# EAGLE design main-v2 (EAGLE 7.2.0)
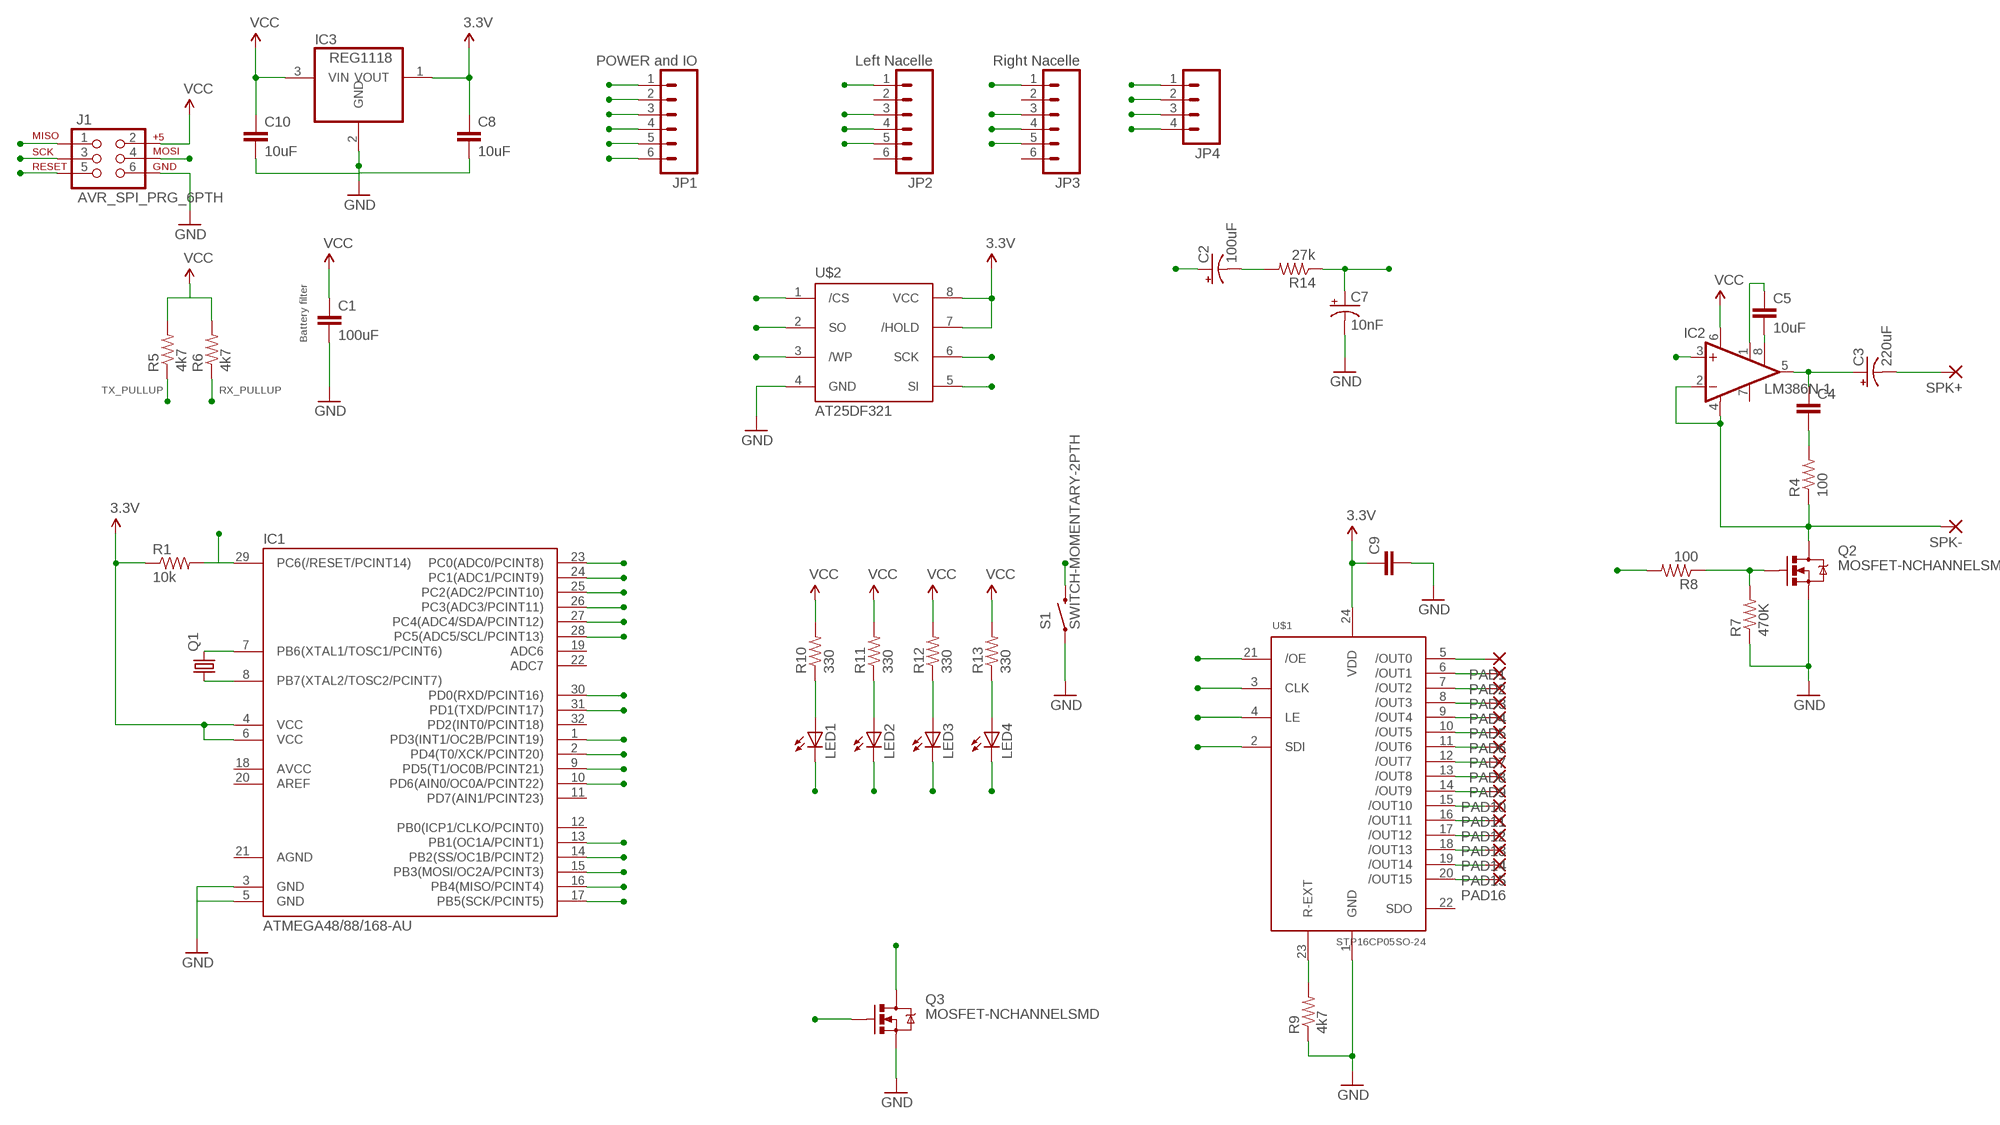
[diagram p0: schematic, sheet 1]

## Parts
C1  100uF  CAPASMD  [CTZ3]
C2  100uF  CAP_POLPTH2  [CPOL-RADIAL-10UF-25V]
C3  220uF  CAP_POLPTH2  [CPOL-RADIAL-10UF-25V]
C4  CAP1206  [1206]
C5  10uF  CAP1206  [1206]
C7  10nF  CAP_POLPTH2  [CPOL-RADIAL-10UF-25V]
C8  10uF  CAPASMD  [CTZ3]
C9  CAP0805  [0805]
C10  10uF  CAPASMD  [CTZ3]
IC1  ATMEGA48/88/168-AU  [TQFP32-08]
IC2  LM386N-1  [DIL08]
IC3  REG1118  [SOT223]
J1  AVR_SPI_PRG_6PTH  [2X3]
JP1  POWER and IO  M06SIP  [1X06]
JP2  Left Nacelle  M06SIP  [1X06]
JP3  Right Nacelle  M06SIP  [1X06]
JP4  M04PTH  [1X04]
LED1  LED0603  [LED-0603]
LED2  LED0603  [LED-0603]
LED3  LED0603  [LED-0603]
LED4  LED0603  [LED-0603]
PAD1  SMD2  [SMD1,27-2,54]
PAD2  SMD2  [SMD1,27-2,54]
PAD3  SMD2  [SMD1,27-2,54]
PAD4  SMD2  [SMD1,27-2,54]
PAD5  SMD2  [SMD1,27-2,54]
PAD6  SMD2  [SMD1,27-2,54]
PAD7  SMD2  [SMD1,27-2,54]
PAD8  SMD2  [SMD1,27-2,54]
PAD9  SMD2  [SMD1,27-2,54]
PAD10  SMD2  [SMD1,27-2,54]
PAD11  SMD2  [SMD1,27-2,54]
PAD12  SMD2  [SMD1,27-2,54]
PAD13  SMD2  [SMD1,27-2,54]
PAD14  SMD2  [SMD1,27-2,54]
PAD15  SMD2  [SMD1,27-2,54]
PAD16  SMD2  [SMD1,27-2,54]
Q1  CRYSTALCTS406  [CTS406]
Q2  MOSFET-NCHANNELSMD  [SOT23-3]
Q3  MOSFET-NCHANNELSMD  [SOT23-3]
R1  10k  RESISTOR0805-RES  [0805]
R4  100  RESISTOR1206  [1206]
R5  4k7  RESISTOR0805-RES  [0805]
R6  4k7  RESISTOR0805-RES  [0805]
R7  470K  RESISTOR1206  [1206]
R8  100  RESISTOR1206  [1206]
R9  4k7  RESISTOR0805-RES  [0805]
R10  330  RESISTOR0805-RES  [0805]
R11  330  RESISTOR0805-RES  [0805]
R12  330  RESISTOR0805-RES  [0805]
R13  330  RESISTOR0805-RES  [0805]
R14  27k  RESISTOR1206  [1206]
S1  SWITCH-MOMENTARY-2PTH  [TACTILE-PTH]
SPK+  SMD5  [SMD2,54-5,08]
SPK-  SMD5  [SMD2,54-5,08]
U$1  STP16CP05SO-24  [SO-24]
U$2  AT25DF321  [WSOIC-8]

## Nets
3.3V: C8.+ C9.1 IC1.4(VCC) IC1.6(VCC) IC3.1(VOUT) R1.1 U$1.24(VDD) U$2.7(/HOLD) U$2.8(VCC)
/OE: IC1.13(PB1(OC1A/PCINT1)) U$1.21(/OE)
/SS: IC1.14(PB2(SS/OC1B/PCINT2)) U$1.4(LE) U$2.1(/CS)
AUDIO_PWR: IC1.2(PD4(T0/XCK/PCINT20)) R8.2
FILTERED_PWM: C7.1(+) IC2.3(+IN) R14.1
GND: C1.- C7.2(-) C8.- C9.2 C10.- IC1.3(GND) IC1.5(GND) IC3.2(GND) J1.6 JP1.6 JP4.4 Q2.2(S) Q3.2(S) R7.1 R9.1 S1.1 U$1.1(GND) U$2.4(GND)
LED1: IC1.23(PC0(ADC0/PCINT8)) LED1.C
LED2: IC1.24(PC1(ADC1/PCINT9)) LED2.C
LED3: IC1.25(PC2(ADC2/PCINT10)) LED3.C
LED4: IC1.26(PC3(ADC3/PCINT11)) LED4.C
MISO: IC1.16(PB4(MISO/PCINT4)) J1.1 U$2.2(SO)
MOSI: IC1.15(PB3(MOSI/OC2A/PCINT3)) J1.4 U$1.2(SDI) U$2.5(SI)
N$2: IC1.8(PB7(XTAL2/TOSC2/PCINT7)) Q1.1
N$3: IC1.7(PB6(XTAL1/TOSC1/PCINT6)) Q1.3
N$4: C3.1(+) C4.1 IC2.5(OUT)
N$5: C5.1 IC2.1(GAIN)
N$6: C4.2 R4.2
N$7: C5.2 IC2.8(GAIN)
N$8: Q2.1(G) R7.2 R8.1
N$9: IC2.2(-IN) IC2.4(GND) Q2.3(D) R4.1 SPK-.1(P)
N$10: LED1.A R10.1
N$11: LED2.A R11.1
N$12: R9.2 U$1.23(R-EXT)
N$13: LED3.A R12.1
N$14: LED4.A R13.1
N$15: PAD1.1(P) U$1.5(/OUT0)
N$16: PAD2.1(P) U$1.6(/OUT1)
N$17: PAD3.1(P) U$1.7(/OUT2)
N$18: PAD4.1(P) U$1.8(/OUT3)
N$19: PAD5.1(P) U$1.9(/OUT4)
N$20: PAD6.1(P) U$1.10(/OUT5)
N$21: PAD7.1(P) U$1.11(/OUT6)
N$22: PAD8.1(P) U$1.12(/OUT7)
N$23: PAD9.1(P) U$1.13(/OUT8)
N$24: PAD10.1(P) U$1.14(/OUT9)
N$25: PAD11.1(P) U$1.15(/OUT10)
N$26: PAD12.1(P) U$1.16(/OUT11)
N$27: PAD13.1(P) U$1.17(/OUT12)
N$28: PAD14.1(P) U$1.18(/OUT13)
N$29: PAD15.1(P) U$1.19(/OUT14)
N$30: PAD16.1(P) U$1.20(/OUT15)
N$33: C2.2(-) R14.2
N$40: U$2.3(/WP)
NCL_GND: JP2.5 JP3.5 Q3.3(D)
NCL_PWR: IC1.9(PD5(T1/OC0B/PCINT21)) Q3.1(G)
PWM_AUDIO: C2.1(+) IC1.1(PD3(INT1/OC2B/PCINT19))
PWR_SW: IC1.10(PD6(AIN0/OC0A/PCINT22)) S1.3
RESET: IC1.29(PC6(/RESET/PCINT14)) J1.5 R1.2
RX: IC1.30(PD0(RXD/PCINT16)) JP1.2 R6.1
SCK: IC1.17(PB5(SCK/PCINT5)) J1.3 U$1.3(CLK) U$2.6(SCK)
SCL: IC1.28(PC5(ADC5/SCL/PCINT13)) JP2.3 JP3.3 JP4.2
SDA: IC1.27(PC4(ADC4/SDA/PCINT12)) JP2.1 JP3.1 JP4.1
SPK+: C3.2(-) SPK+.1(P)
TX: IC1.31(PD1(TXD/PCINT17)) JP1.1 R5.1
VBATT: C1.+ JP1.5 JP2.4 JP3.4 JP4.3 ; supply symbol labelled VCC
VBUS: JP1.3
VCC: JP1.4 R5.2 R6.2 R10.2 R11.2 R12.2 R13.2
VCC+5V: C10.+ IC2.6(VS) IC3.3(VIN) J1.2 ; supply symbol labelled VCC
Unconnected: IC1.11(PD7(AIN1/PCINT23)) IC1.12(PB0(ICP1/CLKO/PCINT0)) IC1.18(AVCC) IC1.19(ADC6) IC1.20(AREF) IC1.22(ADC7) IC1.32(PD2(INT0/PCINT18)) IC2.7(BYPASS) JP2.2 JP2.6 JP3.2 JP3.6 U$1.22(SDO)

## Notes on the sheet
- Battery filter
- TX_PULLUP | RX_PULLUP

## Power pins joined to a net without a drawn wire
AGND: IC1.21(AGND)

## Library data of the parts
C1 C4 C5 C8-C10 = SparkFun:CAP: Capacitor Standard 0603 ceramic capacitor, and 0.1" leaded capacitor.
C2 C3 C7 = SparkFun:CAP_POL: Capacitor Polarized These are standard SMD and PTH capacitors. Normally 10uF, 47uF, and 100uF in electrolytic and tantalum varieties. Always verify the external diameter of the through hole cap, it varies with capacity, voltage, and manufacturer. The EIA devices should be standard.
IC1 = atmega8:ATMEGA48/88/168
IC2 = linear:LM386?-*: Low Voltage Audio Power Amplifier Source: http://cache.national.com/ds/LM/LM386.pdf
IC3 = burr-brown:REG1118: 800mA Low Dropout (LDO) Positive Regulator with Current Source and Sink Capability; MPN: REG1118-2.85/2K5G4; OC_FARNELL: unknown; OC_NEWARK: 14M2185
J1 = SparkFun:AVR_SPI_PRG_6: AVR ISP 6 Pin This is the reduced ISP connector for AVR programming. Common on Arduino. This footprint will take up less PCB space and can be used with a 10-pin to 6-pin adapter such as SKU: BOB-08508
JP1-JP3 = SparkFun:M06: Header 6 Standard 6-pin 0.1" header. Use with straight break away headers (SKU : PRT-00116), right angle break away headers (PRT-00553), swiss pins (PRT-00743), machine pins (PRT-00117), and female headers (PRT-00115). Molex polarized connector foot print use with SKU : PRT-08094 with associated crimp pins and housings. NOTES ON THE VARIANTS LOCK and LOCK_LONGPADS... This footprint was designed to help hold the alignment of a through-hole component (i.e. 6-pin header) while soldering it into place. You may notice that each hole has been shifted either up or down by 0.005 of an inch from it's more standard position (which is a perfectly straight line). This slight alteration caused the pins (the squares in the middle) to touch the edges of the holes. Because they are alternating, it causes a "brace" to hold the component in place. 0.005 has proven to be the perfect amount of "off-center" position when using our standard breakaway headers. Although looks a little odd when you look at the bare footprint, once you have a header in there, the alteration is very hard to notice. Also, if you push a header all the way into place, it is covered up entirely on the bottom side. This idea of altering the position of holes to aid alignment will be further integrated into the Sparkfun Library for other footprints. It can help hold any component with 3 or more connection pins.
JP4 = SparkFun:M04: Header 4 Standard 4-pin 0.1" header. Use with straight break away headers (SKU : PRT-00116), right angle break away headers (PRT-00553), swiss pins (PRT-00743), machine pins (PRT-00117), and female headers (PRT-00115). Molex polarized connector foot print use with SKU : PRT-08231 with associated crimp pins and housings. 1MM SMD Version SKU: PRT-10208
LED1-LED4 = SparkFun:LED: LEDs Standard schematic elements and footprints for 5mm, 3mm, 1206, and 0603 sized LEDs. 5mm - Spark Fun Electronics SKU : COM-00529 (and others)
PAD1-PAD16 = wirepad:SMD2: SMD PAD
Q1 = crystal:CRYSTAL: CRYSTAL; OC_FARNELL: unknown; OC_NEWARK: unknown
Q2 Q3 = SparkFun:MOSFET-NCHANNEL
R1 R4-R14 = SparkFun:RESISTOR: Resistor Basic schematic elements and footprints for 0603, 1206, and PTH resistors.
S1 = SparkFun:SWITCH-MOMENTARY-2
SPK+ SPK- = wirepad:SMD5: SMD PAD
U$1 = Synapseware:STP16CP05
U$2 = Synapseware:AT25DF321: 32-megabit, 2.7-volt Minimum SPI Serial Flash Memory

## Board
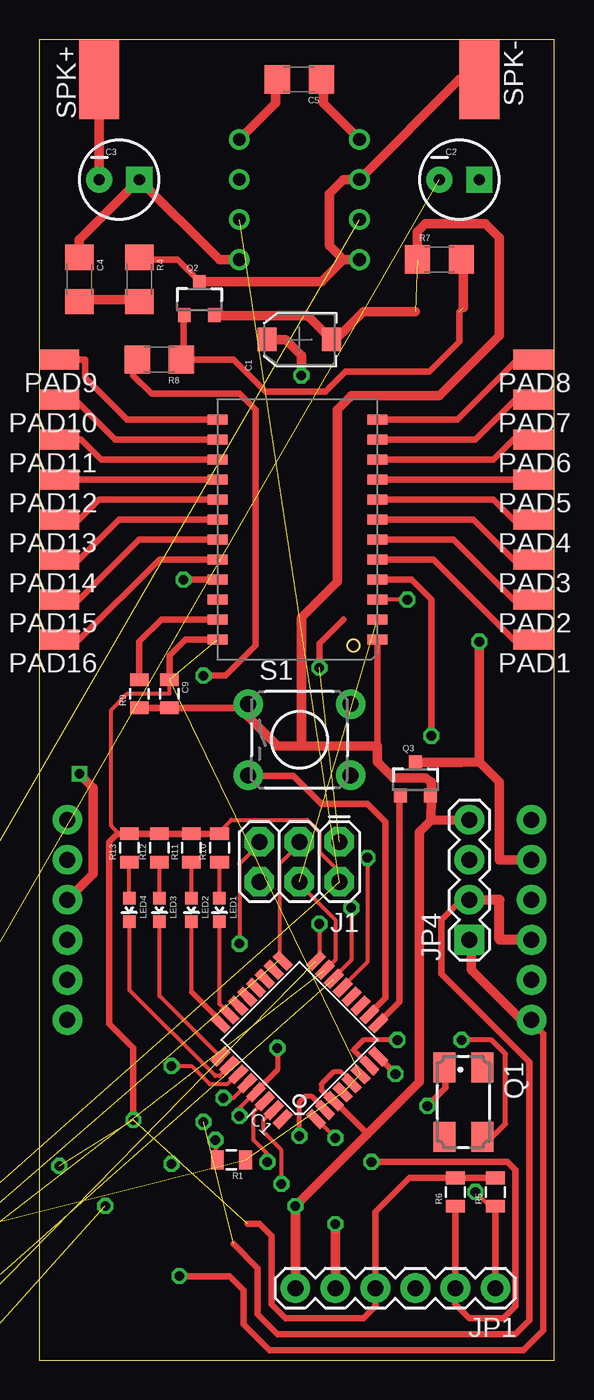
[diagram p1: board, top side]
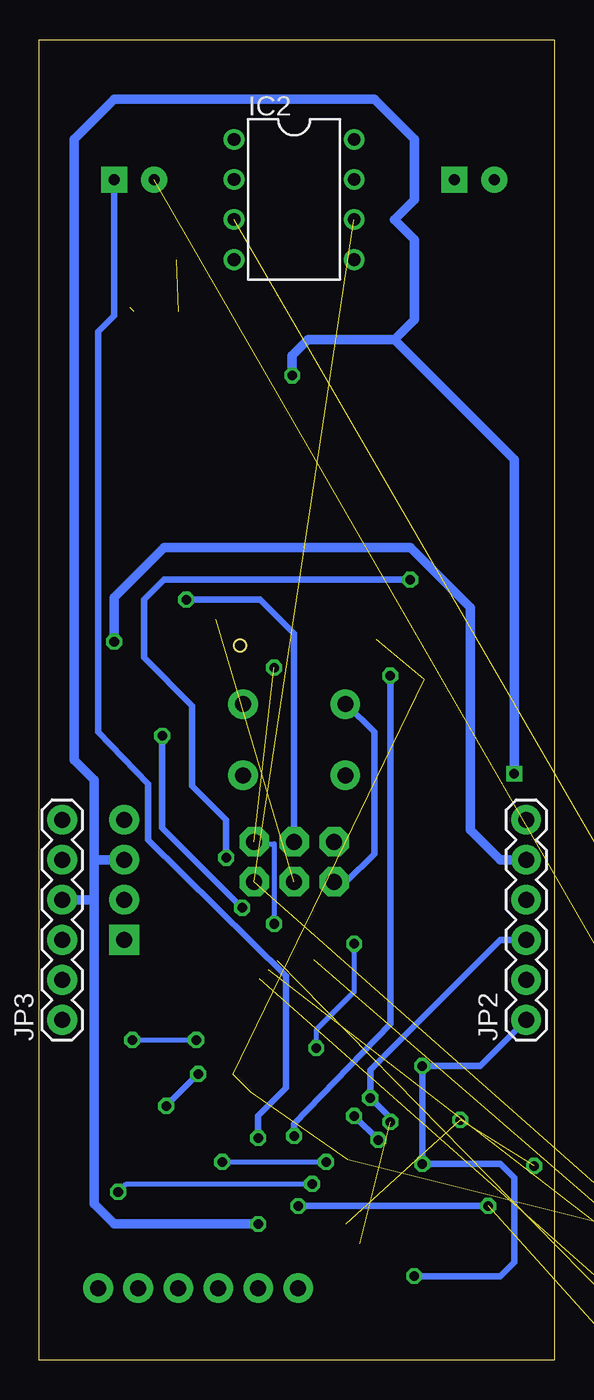
[diagram p2: board, bottom side, seen from below]

Size 32.69 x 83.81 mm. Coordinates in mm from the lower left corner, seen from the top.
Outline: 0,0 32.69,0 32.69,83.81 0,83.81 0,0
Copper layers (1*16): Top 0.035mm / dielectric 1.5mm / Bottom 0.035mm
Design rules "default": minimum track width 10mil, minimum drill 24mil, track to track 8mil, track to pad 8mil, pad to pad 8mil, via to via 8mil, smd to smd 8mil, copper to edge 40mil, drill to drill 8mil, minimum pad ring 10mil, minimum via ring 8mil, stop-mask expansion 4mil, vias tented up to drill 0mil, thermal gap 10mil
tRestrict: area 0,0 to 12.7,3.8

### Footprints (pad centres in the part's own frame; a part is rotated, then mirrored left to right if it is on the bottom)
CTZ3 = smd 1.5 x 1.2: + 0,2.05; - 0,-2.05
CPOL-RADIAL-10UF-25V = drill 0.7 pad 1.651 square: 1 1.27,0 | drill 0.7 pad 1.651: 2 -1.27,0
1206 = smd 1.6 x 1.8: 1 -1.4,0; 2 1.4,0
0805 = smd 0.8 x 1.2: 1 -0.9,0; 2 0.9,0
TQFP32-08 = smd 1.27 x 0.559: 1 -4.293,2.8; 2 -4.293,2; 3 -4.293,1.2; 4 -4.293,0.4; 5 -4.293,-0.4; 6 -4.293,-1.2; 7 -4.293,-2; 8 -4.293,-2.8; 17 4.293,-2.8; 18 4.293,-2; 19 4.293,-1.2; 20 4.293,-0.4; 21 4.293,0.4; 22 4.293,1.2; 23 4.293,2; 24 4.293,2.8 | smd 0.559 x 1.27: 9 -2.8,-4.293; 10 -2,-4.293; 11 -1.2,-4.293; 12 -0.4,-4.293; 13 0.4,-4.293; 14 1.2,-4.293; 15 2,-4.293; 16 2.8,-4.293; 25 2.8,4.293; 26 2,4.293; 27 1.2,4.293; 28 0.4,4.293; 29 -0.4,4.293; 30 -1.2,4.293; 31 -2,4.293; 32 -2.8,4.293
DIL08 = drill 0.813 pad 1.27: 1 -3.81,-3.81; 2 -1.27,-3.81; 3 1.27,-3.81; 4 3.81,-3.81; 5 3.81,3.81; 6 1.27,3.81; 7 -1.27,3.81; 8 -3.81,3.81
SOT223 = smd 1.499 x 2.007: 1 -2.261,-3.15; 2 0.025,-3.15; 3 2.311,-3.15 | smd 3.81 x 2.007: 4 0,3.15
2X3 = drill 1.016 pad 1.88 octagon: 1 0,0; 2 0,2.54; 3 2.54,0; 4 2.54,2.54; 5 5.08,0; 6 5.08,2.54
1X06 = drill 1.016 pad 1.88: 1 0,0; 2 2.54,0; 3 5.08,0; 4 7.62,0; 5 10.16,0; 6 12.7,0
1X04 = drill 1.016 pad 1.88 square: 1 0,0 | drill 1.016 pad 1.88: 2 2.54,0; 3 5.08,0; 4 7.62,0
LED-0603 = smd 0.8 x 0.8: A 0,-0.75; C 0,0.75
SMD1,27-2,54 = smd 1.27 x 2.54: 1 0,0
CTS406 = smd 1.9 x 1.4: 1 -2.2,-1.2; 2 2.2,-1.2; 3 2.2,1.2; 4 -2.2,1.2
SOT23-3 = smd 0.8 x 0.9: 1 -0.95,-1; 2 0.95,-1; 3 0,1.1
TACTILE-PTH = drill 1.016 pad 1.88: 1 -3.251,2.261; 2 3.251,2.261; 3 -3.251,-2.261; 4 3.251,-2.261
SMD2,54-5,08 = smd 2.54 x 5.08: 1 0,0
SO-24 = smd 1.27 x 0.635: 1 -5.08,7.62; 2 -5.08,6.35; 3 -5.08,5.08; 4 -5.08,3.81; 5 -5.08,2.54; 6 -5.08,1.27; 7 -5.08,0; 8 -5.08,-1.27; 9 -5.08,-2.54; 10 -5.08,-3.81; 11 -5.08,-5.08; 12 -5.08,-6.35; 13 5.08,-6.35; 14 5.08,-5.08; 15 5.08,-3.81; 16 5.08,-2.54; 17 5.08,-1.27; 18 5.08,0; 19 5.08,1.27; 20 5.08,2.54; 21 5.08,3.81; 22 5.08,5.08; 23 5.08,6.35; 24 5.08,7.62
WSOIC-8 = smd 0.508 x 1.27: 1 -1.855,-3.486; 2 -0.585,-3.486; 3 0.685,-3.486; 4 1.955,-3.486; 5 1.955,3.413; 6 0.685,3.413; 7 -0.585,3.413; 8 -1.855,3.413

### Placement (x,y rotation side)
C1  16.51,64.77 90 top
C2  26.67,74.93 0 top
C3  5.08,74.93 0 top
C4  2.54,68.58 270 top
C5  16.51,81.28 180 top
C7  -20.32,4.45 0 top  (outside the outline)
C8  -24.77,0 0 top  (outside the outline)
C9  8.26,42.29 270 top
C10  -29.21,0 0 top  (outside the outline)
IC1  16.51,20.32 135 top
IC2  16.51,73.66 270 bottom
IC3  -13.97,6.35 0 top  (outside the outline)
J1  19.05,32.89 180 top
JP1  28.96,4.57 180 top
JP2  1.78,21.59 90 bottom
JP3  31.24,21.59 90 bottom
JP4  27.3,26.67 90 top
LED1  11.43,28.57 180 top
LED2  9.65,28.57 180 top
LED3  7.62,28.57 180 top
LED4  5.71,28.57 180 top
PAD1  31.37,45.72 90 top
PAD2  31.37,48.26 90 top
PAD3  31.37,50.8 90 top
PAD4  31.37,53.34 90 top
PAD5  31.37,55.88 90 top
PAD6  31.37,58.42 90 top
PAD7  31.37,60.96 90 top
PAD8  31.37,63.5 90 top
PAD9  1.27,63.5 90 top
PAD10  1.27,60.96 90 top
PAD11  1.27,58.42 90 top
PAD12  1.27,55.88 90 top
PAD13  1.27,53.34 90 top
PAD14  1.27,50.8 90 top
PAD15  1.27,48.26 90 top
PAD16  1.27,45.72 90 top
Q1  26.92,16.38 270 top
Q2  10.16,67.31 0 top
Q3  23.88,36.83 0 top
R1  12.19,12.7 180 top
R4  6.35,68.58 270 top
R5  28.96,10.67 90 top
R6  26.42,10.67 90 top
R7  25.4,69.85 0 top
R8  7.62,63.5 180 top
R9  6.35,42.29 90 top
R10  11.43,32.51 90 top
R11  9.65,32.51 90 top
R12  7.62,32.51 90 top
R13  5.71,32.51 90 top
R14  -20.32,-1.91 0 top  (outside the outline)
S1  16.51,39.37 0 top
SPK+  3.81,81.28 0 top
SPK-  27.94,81.28 180 top
U$1  16.38,53.34 180 top
U$2  -5.71,4.45 0 top  (outside the outline)

### Tracks (layer width: path | path; a pad name or v marks a point on that pad's centre or on a via)
3.3V  (8 unrouted)
/OE  (via drill 0.61)
  Top 0.254: v20.83,31.88 20.83,25.27 19.43,23.88 IC1.13
  Top 0.406: U$1.21 v9.14,49.53
  Bottom 0.406: v9.14,49.53 24.77,49.53 26.04,48.26 26.04,44.58 22.99,41.53 22.99,36.45 20.83,34.29 v20.83,31.88
/SS  (via drill 0.61)  (1 unrouted)
  Top 0.254: v19.81,28.7 19.81,25.4 18.8,24.38 IC1.14 | U$1.4 21.84,49.53
  Top 0.406: v24.89,39.62 24.89,48.26 23.62,49.53 21.84,49.53
  Bottom 0.254: v24.89,39.62 24.89,39.12
  Bottom 0.406: v19.81,28.7 24.89,33.78 24.89,39.12
AUDIO_PWR  (via drill 0.61)
  Top 0.254: 18.03,16 IC1.2 | 5.97,63.5 R8.2
  Top 0.305: 18.03,16 17.27,16.76 16.89,16.76 16.51,16.38 v16.51,14.22
  Top 0.406: v10.41,43.43 11.81,43.43 13.72,45.34 13.72,60.33 12.7,61.34 7.11,61.34 5.97,62.48 5.97,63.5
  Bottom 0.406: v16.51,14.22 16.51,14.99 10.41,21.34 v10.41,43.43
FILTERED_PWM  (2 unrouted)
GND  (via drill 0.6, 0.61)  (6 unrouted)
  Top 0.254: 6.1,41.4 R9.1 | 7.87,41.4 C9.2 8.26,41.4 | 11.18,66.29 Q2.2 | 18.54,64.77 C1.- 18.8,64.77 | 13.21,41.4 S1.1 | 19.18,18.29 19.81,17.78 IC1.5 | 18.54,16.51 IC1.3 18.8,16.38
  Top 0.305: 18.54,16.51 17.91,17.14 17.91,17.53 18.67,18.29 19.18,18.29
  Top 0.406: 7.87,41.4 6.1,41.4 | 13.21,41.4 8.26,41.4 | Q3.2 24.88,35.83 | U$1.1 21.46,38.99 | S1.1 13.26,40.84 | 16.64,39.12 16.51,38.99 | 20.83,14.35 18.8,16.38
  Top 0.61: 11.18,66.29 17.02,66.29 18.54,64.77 | 23.88,66.55 20.57,66.55 18.8,64.77 | JP4.4 27.38,34.29 24.87,34.27 | 24.87,34.27 24.89,35.69 24.83,35.63 Q3.2 | 24.88,35.83 24.88,36.69 24.51,36.96 22.48,36.96 21.46,37.97 21.46,38.99 16.51,38.99 15.11,38.99 13.26,40.84 | R7.1 24,71.62 24.51,72.14 28.32,72.14 29.21,71.25 29.21,65.02 25.4,61.21 19.81,61.21 18.92,60.33 18.92,49.4 16.64,47.12 16.64,39.12 | JP1.6 v16.26,9.78 20.83,14.35 24.13,17.65 24.13,33.53 24.87,34.27
  Bottom 0.254: 13.21,30.35 J1.6 | 13.21,41.66 S1.1
  Bottom 0.406: 13.21,30.35 11.43,32.13 11.43,39.88 13.21,41.66 | v16.26,9.78 v4.19,9.78
LED1
  Top 0.254: IC1.23 11.94,22.1 11.43,22.61 LED1.C
LED2
  Top 0.254: 11.43,21.59 IC1.24 | 9.65,23.37 LED2.C
  Top 0.305: 11.43,21.59 9.65,23.37
LED3
  Top 0.254: IC1.25 11.43,19.3 7.62,23.11 LED3.C
LED4
  Top 0.254: IC1.26 11.94,18.54 11.43,18.03 11.18,18.03 5.71,23.5 LED4.C
MISO  (via drill 0.61)  (2 unrouted)
  Top 0.254: v17.78,27.69 17.78,25.4 IC1.16
  Top 0.406: 19.3,46.99 17.78,45.47 v17.78,43.94
  Bottom 0.254: 19.05,32.77 J1.1
  Bottom 0.305: v17.78,27.69 17.78,32.77 19.05,32.77
MOSI  (2 unrouted)
  Top 0.254: IC1.15 18.29,24.89 18.8,25.4 18.8,27.94 16.51,30.23 J1.4
N$2  (via drill 0.61)
  Top 0.254: 21.59,19.18 IC1.8 | 25.78,18.67 Q1.1
  Top 0.406: v22.61,18.16 21.59,19.18 | 25.78,18.67 25.78,17.27 v24.64,16.13
  Bottom 0.406: v24.64,16.13 v22.61,18.16
N$3  (via drill 0.6, 0.61)
  Top 0.254: 20.83,18.8 IC1.7 | 28.83,14.22 Q1.3
  Top 0.305: 20.83,18.8 19.94,19.68 20.57,20.32 v22.73,20.32 | v26.8,20.32 28.7,20.32 29.59,19.43 29.59,14.99 28.83,14.22
  Bottom 0.305: v26.8,20.32 v22.73,20.32
N$4
  Top 0.61: C4.1 2.54,71.12 C3.1 11.43,69.85 IC2.5
N$5
  Top 0.254: 18.03,81.28 C5.1
  Top 0.61: 18.03,81.28 18.03,79.76 IC2.1
N$6
  Top 0.254: 2.54,67.31 C4.2 | 6.35,67.31 R4.2
  Top 0.61: 6.35,67.31 2.54,67.31
N$7
  Top 0.254: 14.99,81.28 C5.2
  Top 0.61: 14.99,81.28 14.99,79.76 IC2.8
N$8  (1 unrouted)
  Top 0.254: 26.92,69.85 R7.2 | 9.14,66.29 Q2.1 | 9.14,63.5 R8.1
  Top 0.406: 9.14,66.29 9.14,63.5 12.32,63.5 14.35,61.47 18.16,61.47 19.43,62.74 24.77,62.74 26.67,64.64 26.67,66.55
  Top 0.61: 26.92,69.85 26.92,66.8
N$9
  Top 0.254: 6.35,69.85 R4.1 | 10.16,68.45 Q2.3 | 26.67,81.28 SPK-.1
  Top 0.406: 10.16,68.45 8.76,69.85 6.35,69.85
  Top 0.61: 19.3,69.85 18.41,70.74 18.41,74.04 19.3,74.93 IC2.2 26.67,81.28 | 10.16,68.45 17.91,68.45 19.3,69.85 | IC2.4 19.3,69.85
N$10
  Top 0.254: LED1.A R10.1
N$11
  Top 0.254: LED2.A R11.1
N$12
  Top 0.254: U$1.23 11.05,46.99 | 6.35,43.05 R9.2
  Top 0.406: 11.05,46.99 7.75,46.99 6.35,45.59 6.35,43.05
N$13
  Top 0.254: LED3.A R12.1
N$14
  Top 0.254: LED4.A R13.1
N$15
  Top 0.254: 30.1,45.72 PAD1.1
  Top 0.406: U$1.5 25.02,50.8 30.1,45.72
N$16
  Top 0.254: 30.1,48.26 PAD2.1
  Top 0.406: U$1.6 26.29,52.07 30.1,48.26
N$17
  Top 0.254: 30.1,50.8 PAD3.1
  Top 0.406: U$1.7 27.56,53.34 30.1,50.8
N$18
  Top 0.254: 30.1,53.34 PAD4.1
  Top 0.406: U$1.8 28.83,54.61 30.1,53.34
N$19
  Top 0.406: PAD5.1 U$1.9
N$20
  Top 0.254: 30.1,58.42 PAD6.1
  Top 0.406: U$1.10 28.83,57.15 30.1,58.42
N$21
  Top 0.254: 30.23,60.96 PAD7.1
  Top 0.406: U$1.11 27.69,58.42 30.23,60.96
N$22
  Top 0.254: 30.35,63.5 PAD8.1
  Top 0.406: U$1.12 26.54,59.69 30.35,63.5
N$23
  Top 0.406: U$1.13 5.59,59.69 2.92,62.36 2.92,63.5 PAD9.1
N$24
  Top 0.406: U$1.14 4.83,58.42 2.29,60.96 PAD10.1
N$25
  Top 0.406: U$1.15 3.94,57.15 2.67,58.42 PAD11.1
N$26
  Top 0.406: PAD12.1 U$1.16
N$27
  Top 0.406: U$1.17 3.81,54.61 2.54,53.34 PAD13.1
N$28
  Top 0.406: U$1.18 5.08,53.34 2.54,50.8 PAD14.1
N$29
  Top 0.406: U$1.19 6.35,52.07 2.54,48.26 PAD15.1
N$30
  Top 0.406: U$1.20 7.62,50.8 2.54,45.72 PAD16.1
N$33  (1 unrouted)
NCL_GND  (via drill 0.61)
  Top 0.406: JP3.5 31.11,31.75
  Top 0.61: Q3.3 26.75,37.93 27.94,37.97 | 27.94,37.97 v27.94,45.59 | 31.11,31.75 29.21,31.75 29.21,36.7 27.94,37.97
  Bottom 0.61: v27.94,45.59 27.94,48.39 24.77,51.56 9.14,51.56 5.33,47.75 5.33,33.66 3.43,31.75 JP2.5
NCL_PWR
  Top 0.406: IC1.9 21.52,21.4 22.86,22.73 22.86,35.76 Q3.1
PWM_AUDIO  (via drill 0.61)
  Top 0.254: v18.8,14.1 17.78,15.11 IC1.1
  Bottom 0.254: C2.1 27.94,74.8
  Bottom 0.406: 27.94,74.8 27.94,66.29 28.96,65.28 28.96,39.88 25.78,36.58 25.78,33.02 17.02,24.38 17.02,17.27 18.8,15.49 v18.8,14.1
PWR_SW
  Top 0.254: 21.08,22.1 IC1.10 | 13.34,37.08 S1.3
  Top 0.406: 21.08,22.1 21.97,22.99 21.97,34.16 20.83,35.31 17.91,35.31 16.13,37.08 13.34,37.08
RESET  (via drill 0.6, 0.61)
  Top 0.254: v11.18,13.97 11.18,12.95 R1.2 | v12.7,15.49 12.7,16 13.59,16.89 IC1.29 13.97,17.02 13.97,17.27 14.22,17.53 | v12.7,26.42 12.7,31.5 13.97,32.77 J1.5
  Top 0.305: 14.22,17.53 15.11,18.41 v15.11,19.81
  Bottom 0.305: v15.11,19.81 15.11,20.95 12.7,23.37 v12.7,26.42
  Bottom 0.406: v12.7,15.49 v11.18,13.97
RX  (via drill 0.61)
  Top 0.254: v14.48,12.57 14.48,13.08 13.59,13.97 13.59,15.75 14.35,16.51 14.48,16.51 IC1.30
  Top 0.406: R6.1 JP1.2 26.42,3.56 27.3,2.67 29.46,2.67 30.23,3.43 30.23,12.06 29.72,12.57 v21.08,12.57
  Bottom 0.305: v21.08,12.57 v14.48,12.57
SCK  (via drill 0.61)  (1 unrouted)
  Top 0.254: IC1.17 15.24,25.4 15.24,31.5 16.51,32.77 J1.3 | v23.37,48.26 U$1.3
  Bottom 0.406: v23.37,48.26 18.67,48.26 16.51,46.1 J1.3
SCL  (via drill 0.61)  (1 unrouted)
  Top 0.254: v11.68,16.64 12.32,16.64 12.95,17.27 12.95,17.53 IC1.28
  Top 0.406: 12.32,7.37 13.84,5.84 13.84,2.92 15.11,1.65 30.23,1.65 31.11,2.54 31.11,18.92 25.53,24.51 25.53,27.94 26.8,29.21 JP4.2
  Top 0.61: 28.7,29.21 JP4.2
  Top 0.635: JP3.3 29.21,26.67 29.21,29.21 28.7,29.21
  Bottom 0.406: JP2.3 3.43,26.67 11.68,18.41 v11.68,16.64 10.41,15.37 v10.41,15.11
SDA  (via drill 0.6, 0.61)
  Top 0.254: v8.38,18.67 9.65,18.67 10.79,17.53 11.94,17.53 12.45,18.03 IC1.27 | 27.43,26.67 JP4.1
  Top 0.406: v8.89,5.33 12.06,5.33 12.95,4.45 12.95,2.29 14.61,0.64 30.73,0.64 32,1.91 32,20.7 31.24,21.46 JP3.1
  Top 0.61: 27.43,26.67 27.43,24.77 30.61,21.59 JP3.1
  Bottom 0.406: JP2.1 4.7,18.67 v8.38,18.67 v8.38,12.45 3.43,12.45 2.54,11.56 2.54,6.22 3.43,5.33 v8.89,5.33
SPK+
  Top 0.61: SPK+.1 C3.2
TX  (via drill 0.61)
  Top 0.254: R5.1 28.96,9.4 v27.69,10.67 | v15.37,11.18 15.37,13.34 14.22,14.48 14.22,15.24 14.99,16 IC1.31
  Top 0.406: JP1.1 28.96,9.4
  Bottom 0.305: v15.37,11.18 27.18,11.18 v27.69,10.67
VBATT  (via drill 0.6)
  Top 0.61: JP1.5 v18.8,8.64 | v16.64,62.48 16.64,63.75 15.62,64.77 C1.+ | JP2.4 3.43,30.86 3.43,36.32 v2.54,37.21
  Bottom 0.61: v18.8,8.64 27.94,8.64 29.21,9.91 29.21,29.21 | JP4.3 29.21,31.75 | 29.21,31.75 29.21,29.21 | JP3.4 29.21,29.21 | 29.21,31.75 29.21,36.83 30.48,38.1 30.48,77.47 27.94,80.01 11.43,80.01 8.89,77.47 8.89,73.66 10.16,72.39 8.89,71.12 8.89,66.04 10.16,64.77 | 10.16,64.77 15.62,64.77 16.64,63.75 v16.64,62.48 | v2.54,37.21 2.54,57.15 10.16,64.77
  other vias: 1.78,29.21
VCC  (via drill 0.6)  (2 unrouted)
  Top 0.254: 28.96,11.56 R5.2 | 26.42,11.56 R6.2 | 6.73,33.4 R12.2 | 8.76,33.4 R11.2 | 19.05,30.99 17.78,32.26 17.78,33.53 17.02,34.29 12.19,34.29 11.3,33.4 R10.2 | 8.26,43.31 8.26,42.29 5.59,42.29 4.57,41.27 4.57,33.91 5.08,33.4 R13.2
  Top 0.406: 10.67,45.72 9.27,45.72 8.26,44.7 8.26,43.31 | 28.96,11.56 26.42,11.56 23.5,11.56 21.34,9.4 JP1.4 21.34,3.43 20.57,2.67 15.62,2.67 14.73,3.56 14.73,7.87 13.97,8.64 13.21,8.64 | 5.08,33.4 6.73,33.4 8.76,33.4 11.3,33.4 | v5.97,15.24 5.97,19.81 4.45,21.34 4.45,32.89 4.95,33.4 R13.2
  other vias: 1.27,12.32
VCC+5V  (3 unrouted)